# Altium schematic sheet 002_Buck_Converter.SchDoc: =title_line_1 + title_line_2
size 594 x 420 mm; SheetNumber: 2
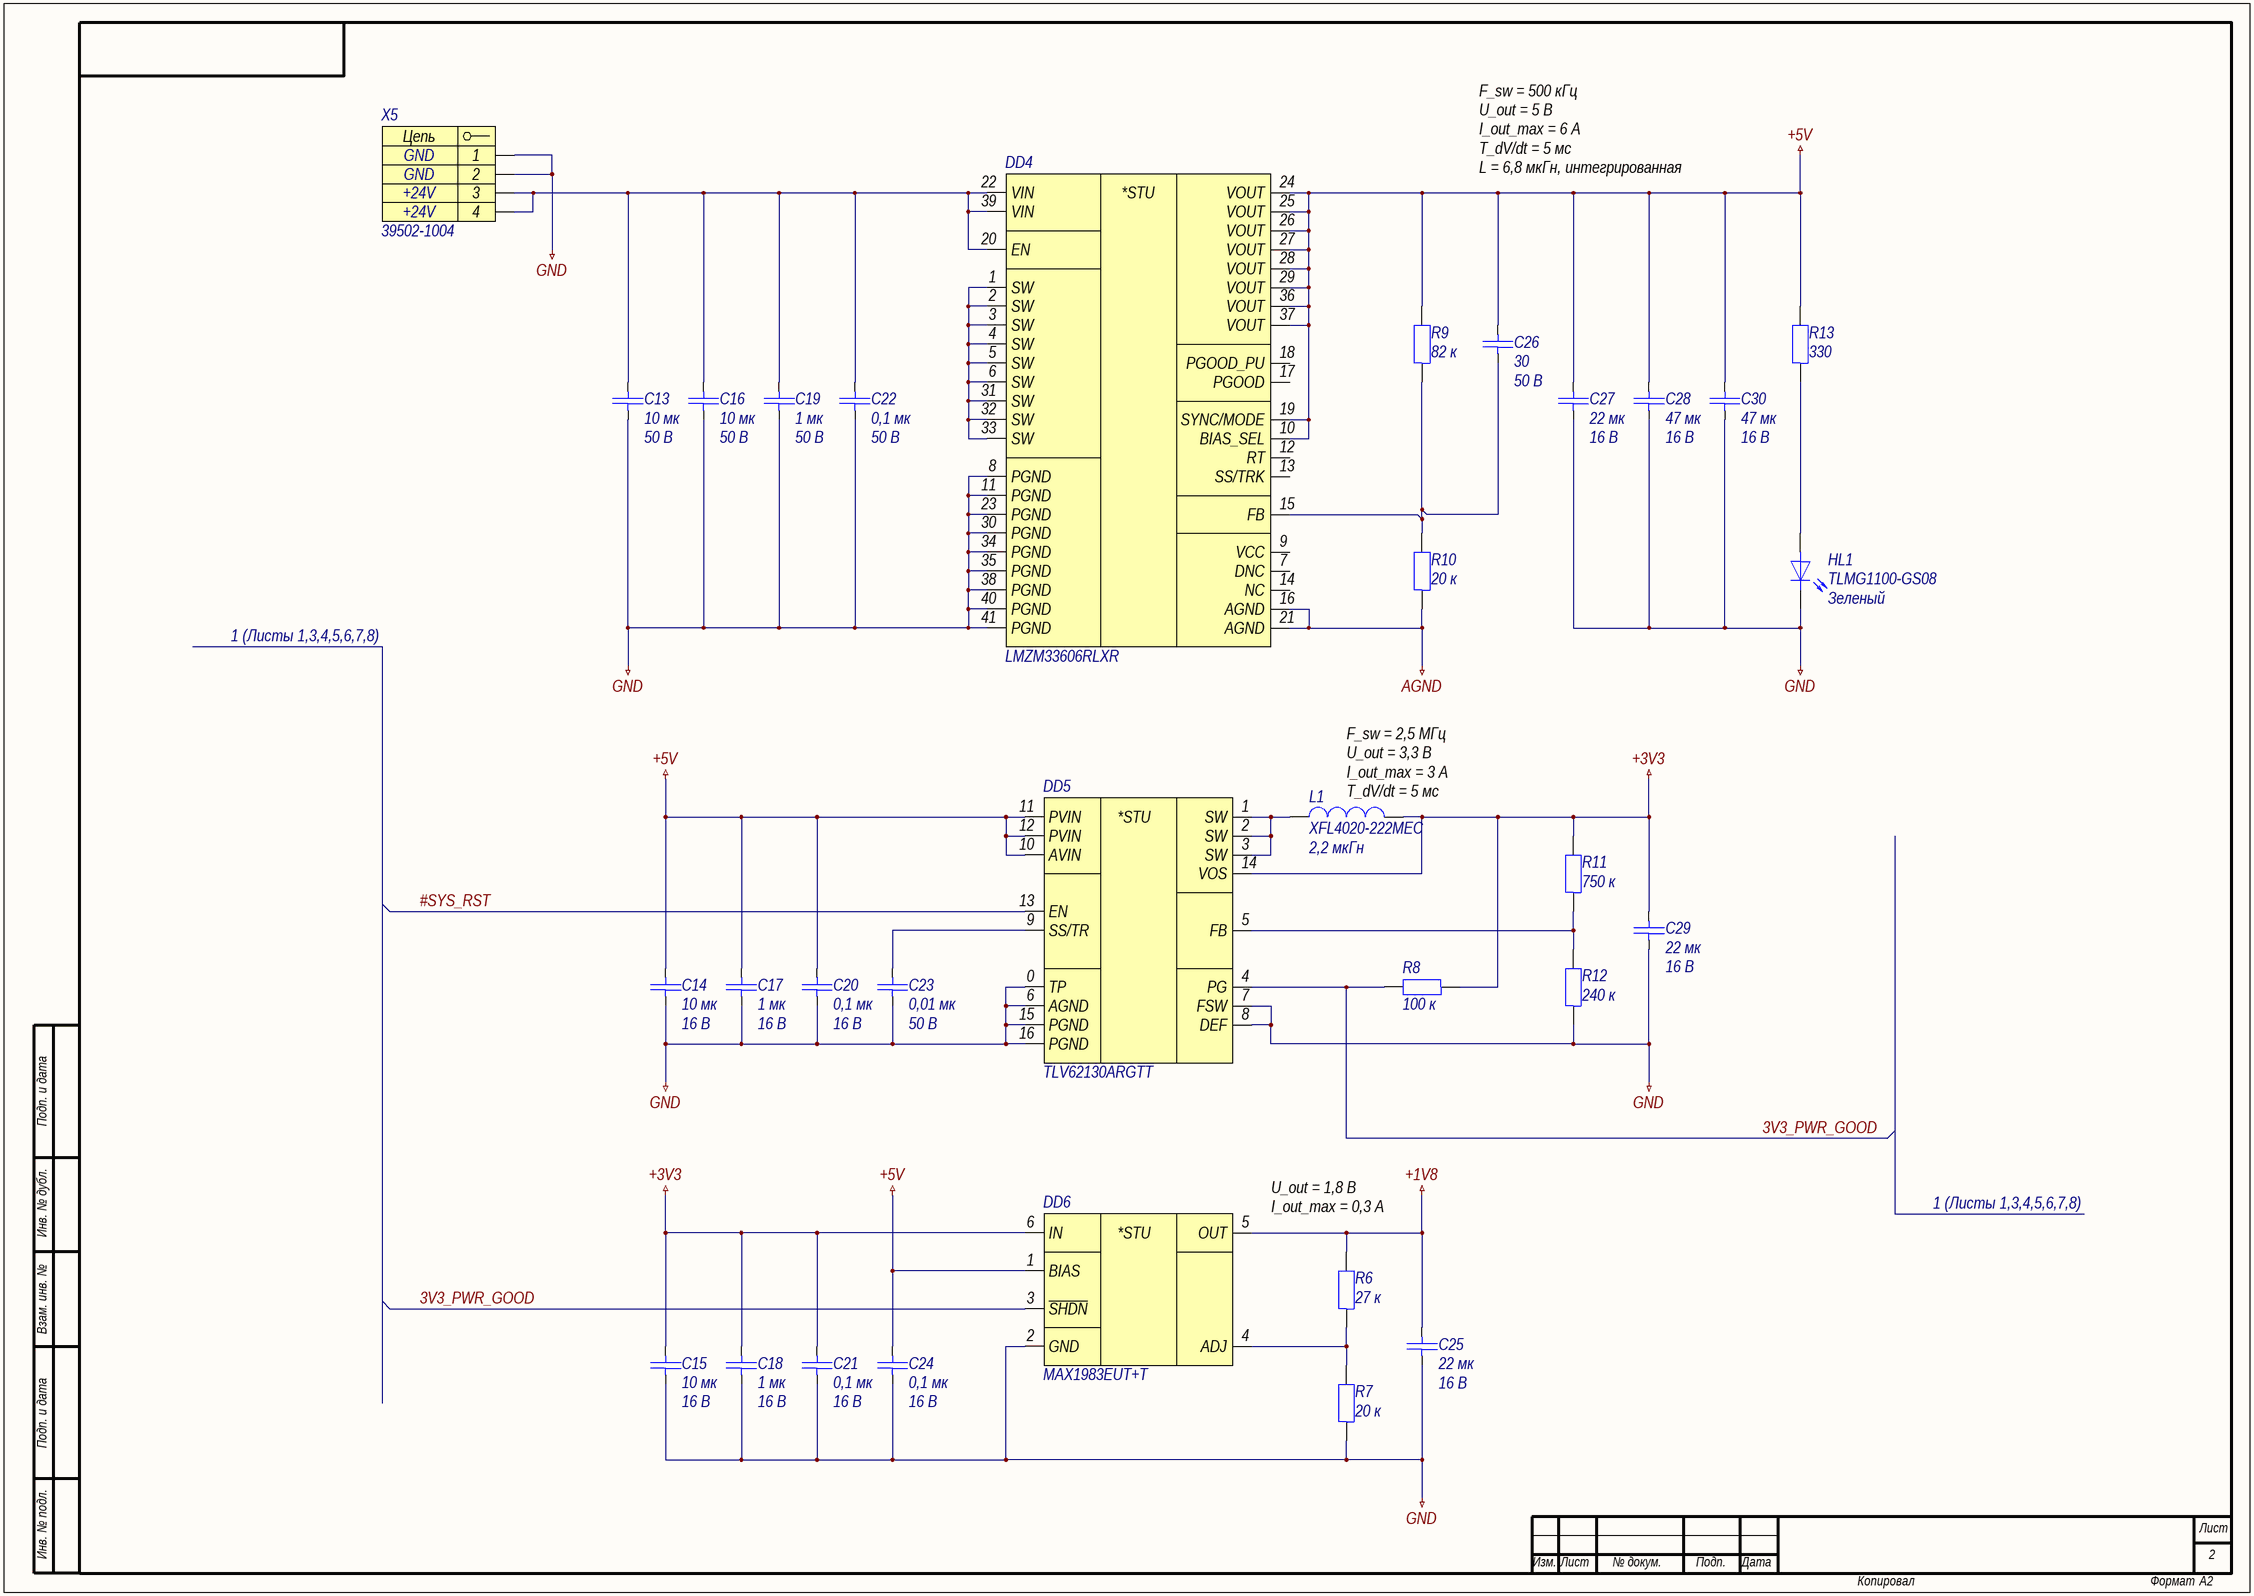
[diagram p0: 002_Buck_Converter.SchDoc]

## Parts
C13  10 мк  Напряжение: 50 В  [C0805]
C14  10 мк  Напряжение: 16 В  [C0603]
C15  10 мк  Напряжение: 16 В  [C0603]
C16  10 мк  Напряжение: 50 В  [C0805]
C17  1 мк  Напряжение: 16 В  [C0603]
C18  1 мк  Напряжение: 16 В  [C0603]
C19  1 мк  Напряжение: 50 В  [C0603]
C20  0,1 мк  Напряжение: 16 В  [C0603]
C21  0,1 мк  Напряжение: 16 В  [C0603]
C22  0,1 мк  Напряжение: 50 В  [C0603]
C23  0,01 мк  Напряжение: 50 В  [C0603]
C24  0,1 мк  Напряжение: 16 В  [C0603]
C25  22 мк  Напряжение: 16 В  [C0805]
C26  30  Напряжение: 50 В  [C0603]
C27  22 мк  Напряжение: 16 В  [C0805]
C28  47 мк  Напряжение: 16 В  [C1206]
C29  22 мк  Напряжение: 16 В  [C0805]
C30  47 мк  Напряжение: 16 В  [C1206]
DD4  LMZM33606RLXR  [B2QFN-41-1600X1000X410]
DD5  TLV62130ARGTT  [WQFN-16-P50-300X300X100-L40X24-T168X168]
DD6  MAX1983EUT+T  [SOT-23-6-P95-290X280X145]
HL1  TLMG1100-GS08  Цвет: Зеленый  [HL0603]
L1  XFL4020-222MEC  Индуктивность: 2,2 мкГн  [XFL-2-400X400X210]
R6  27 к  [R0603]
R7  20 к  [R0603]
R8  100 к  [R0603]
R9  82 к  [R0603]
R10  20 к  [R0603]
R11  750 к  [R0603]
R12  240 к  [R0603]
R13  330  [R0603]
X5  39502-1004  [39502-1004]

## Nets
+1V8: C25.1 DD6.5(OUT) R6.2
+3V3: C15.1 C18.1 C21.1 C29.1 DD5.14(VOS) DD6.6(IN) L1.2 R8.1 R11.2
+5V: C14.1 C17.1 C20.1 C24.1 C26.1 C27.1 C28.1 C30.1 DD4.10(BIAS_SEL) DD4.19(SYNC/MODE) DD4.24(VOUT) DD4.25(VOUT) DD4.26(VOUT) DD4.27(VOUT) DD4.28(VOUT) DD4.29(VOUT) DD4.36(VOUT) DD4.37(VOUT) DD5.10(AVIN) DD5.11(PVIN) DD5.12(PVIN) DD6.1(BIAS) R9.2 R13.2
AGND: DD4.16(AGND) DD4.21(AGND) R10.1
GND: C13.2 C14.2 C15.2 C16.2 C17.2 C18.2 C19.2 C20.2 C21.2 C22.2 C23.2 C24.2 C25.2 C27.2 C28.2 C29.2 C30.2 DD4.8(PGND) DD4.11(PGND) DD4.23(PGND) DD4.30(PGND) DD4.34(PGND) DD4.35(PGND) DD4.38(PGND) DD4.40(PGND) DD4.41(PGND) DD5.0(TP) DD5.6(AGND) DD5.7(FSW) DD5.8(DEF) DD5.15(PGND) DD5.16(PGND) DD6.2(GND) HL1.1 R7.1 R12.1 X5.1 X5.2
3V3_PWR_GOOD: DD5.4(PG) DD6.3(~{SHDN}) R8.2
#SYS_RST: DD5.13(EN)
NetC13_1: C13.1 C16.1 C19.1 C22.1 DD4.20(EN) DD4.22(VIN) DD4.39(VIN) X5.3 X5.4
NetC23_1: C23.1 DD5.9(SS/TR)
NetC26_2: C26.2 DD4.15(FB) R9.1 R10.2
NetDD4_1: DD4.1(SW) DD4.2(SW) DD4.3(SW) DD4.4(SW) DD4.5(SW) DD4.6(SW) DD4.31(SW) DD4.32(SW) DD4.33(SW)
NetDD5_1: DD5.1(SW) DD5.2(SW) DD5.3(SW) L1.1
NetDD5_5: DD5.5(FB) R11.1 R12.2
NetDD6_4: DD6.4(ADJ) R6.1 R7.2
NetHL1_2: HL1.2 R13.1

Not connected (* = marked no-connect by the designer): DD4 7(DNC) 9(VCC) 12(RT) 13(SS/TRK) 14(NC) 17(PGOOD) 18(PGOOD_PU)

## Notes on the sheet
- F_sw = 500 кГц
  U_out = 5 В
  I_out_max = 6 А
  T_dV/dt = 5 мс
  L = 6,8 мкГн, интегрированная
- 1 (Листы 1,3,4,5,6,7,8)
- (near L1) F_sw = 2,5 МГц
  U_out = 3,3 В
  I_out_max = 3 А
  T_dV/dt = 5 мс
- U_out = 1,8 В
  I_out_max = 0,3 А
- Подп. и дата
- Инв. № дубл.
- Взам. инв. №
- Инв. № подл.
- Лист
- Изм.
- № докум.
- Подп.
- Дата
- Копировал
- Формат
- А2
- (in symbol dd0001) *STU
- (in symbol dd0016) *STU
- (in symbol dd0017) *STU
- (in symbol x0051) Цепь

## Library data of the parts
C13 C16 = c0149: =Описание; ID: c0149; Фамилия: Паньков; Описание: Конденсатор керамический чип 0805 10 мкФ 50 В ±10 %; Наименование: CC0805KKX5R9BB106; Производитель: YAGEO Corp.; Отклонение: ±10 %; Рабочие температуры: от –55 °С до +85 °С; Температурный коэффициент емкости: X5R; Корпус: 0805; Номинал: 10 мк; Номинальное напряжение: 50 В; HelpURL: https://www.yageo.com/upload/media/product/productsearch/datasheet/mlcc/UPY-GPHC_X5R_4V-to-50V_26.pdf
C14 C15 = c0145: =Описание; ID: c0145; Фамилия: Паньков; Описание: Конденсатор керамический чип 0603 10 мкФ 16 В ±10 %; Наименование: CC0603KRX5R7BB106; Производитель: YAGEO Corp.; Отклонение: ±10 %; Рабочие температуры: от –55 °С до +85 °С; Температурный коэффициент емкости: X5R; Корпус: 0603; Номинал: 10 мк; Номинальное напряжение: 16 В; HelpURL: https://www.yageo.com/upload/media/product/productsearch/datasheet/mlcc/UPY-GPHC_X5R_4V-to-50V_26.pdf
C17 C18 = c0113: =Описание; ID: c0113; Фамилия: Паньков; Описание: Конденсатор керамический чип 0603 1 мкФ 16 В ±10 %; Наименование: CC0603KRX7R7BB105; Производитель: YAGEO Corp.; Отклонение: ±10 %; Рабочие температуры: от –55 °С до +125 °С; Температурный коэффициент емкости: X7R; Корпус: 0603; Номинал: 1 мк; Номинальное напряжение: 16 В; HelpURL: https://www.yageo.com/upload/media/product/productsearch/datasheet/mlcc/UPY-GPHC_X7R_6.3V-to-50V_20.pdf
C19 = c0117: =Описание; ID: c0117; Фамилия: Паньков; Описание: Конденсатор керамический чип 0603 1 мкФ 50 В ±10 %; Наименование: CC0603KRX7R9BB105; Производитель: YAGEO Corp.; Отклонение: ±10 %; Рабочие температуры: от –55 °С до +125 °С; Температурный коэффициент емкости: X7R; Корпус: 0603; Номинал: 1 мк; Номинальное напряжение: 50 В; HelpURL: https://www.yageo.com/upload/media/product/productsearch/datasheet/mlcc/UPY-GPHC_X7R_6.3V-to-50V_20.pdf
C20 C21 C24 = c0081: =Описание; ID: c0081; Фамилия: Паньков; Описание: Конденсатор керамический чип 0603 100 нФ 16 В ±10 %; Наименование: CC0603KRX7R7BB104; Производитель: YAGEO Corp.; Отклонение: ±10 %; Рабочие температуры: от –55 °С до +125 °С; Температурный коэффициент емкости: X7R; Корпус: 0603; Номинал: 0,1 мк; Номинальное напряжение: 16 В; HelpURL: https://www.yageo.com/upload/media/product/productsearch/datasheet/mlcc/UPY-GPHC_X7R_6.3V-to-50V_20.pdf
C22 = c0086: =Описание; ID: c0086; Фамилия: Паньков; Описание: Конденсатор керамический чип 0603 100 нФ 50 В ±10 %; Наименование: CC0603KRX7R9BB104; Производитель: YAGEO Corp.; Отклонение: ±10 %; Рабочие температуры: от –55 °С до +125 °С; Температурный коэффициент емкости: X7R; Корпус: 0603; Номинал: 0,1 мк; Номинальное напряжение: 50 В; HelpURL: https://www.yageo.com/upload/media/product/productsearch/datasheet/mlcc/UPY-GPHC_X7R_6.3V-to-50V_20.pdf
C23 = c0056: =Описание; ID: c0056; Фамилия: Паньков; Описание: Конденсатор керамический чип 0603 10 нФ 50 В ±10 %; Наименование: CC0603KRX7R9BB103; Производитель: YAGEO Corp.; Отклонение: ±10 %; Рабочие температуры: от –55 °С до +125 °С; Температурный коэффициент емкости: X7R; Корпус: 0603; Номинал: 0,01 мк; Номинальное напряжение: 50 В; HelpURL: https://www.yageo.com/upload/media/product/productsearch/datasheet/mlcc/UPY-GPHC_X7R_6.3V-to-50V_20.pdf
C25 C27 C29 = c0159: =Описание; ID: c0159; Фамилия: Паньков; Описание: Конденсатор керамический чип 0805 22 мкФ 16 В ±20 %; Наименование: CC0805MRX5R7BB226; Производитель: YAGEO Corp.; Отклонение: ±20 %; Рабочие температуры: от –55 °С до +85 °С; Температурный коэффициент емкости: X5R; Корпус: 0805; Номинал: 22 мк; Номинальное напряжение: 16 В; HelpURL: https://www.yageo.com/upload/media/product/productsearch/datasheet/mlcc/UPY-GPHC_X5R_4V-to-50V_26.pdf
C26 = c0022: =Описание; ID: c0022; Фамилия: Ларионов; Описание: Конденсатор керамический чип 0603 30 пФ 50 В ±5 %; Наименование: CC0603JRNPO9BN300; Производитель: YAGEO Corp.; Отклонение: ±5 %; Рабочие температуры: от –55 °С до +125 °С; Температурный коэффициент емкости: C0G; Корпус: 0603; Номинал: 30; Номинальное напряжение: 50 В; HelpURL: https://www.yageo.com/upload/media/product/productsearch/datasheet/mlcc/UPY-GP_NP0_16V-to-50V_18.pdf
C28 C30 = c0168: =Описание; ID: c0168; Фамилия: Паньков; Описание: Конденсатор керамический чип 1206 47 мкФ 16 В ±20 %; Наименование: CC1206MKX5R7BB476; Производитель: YAGEO Corp.; Отклонение: ±20 %; Рабочие температуры: от –55 °С до +85 °С; Температурный коэффициент емкости: X5R; Корпус: 1206; Номинал: 47 мк; Номинальное напряжение: 16 В; HelpURL: https://www.yageo.com/upload/media/product/productsearch/datasheet/mlcc/UPY-GPHC_X5R_4V-to-50V_26.pdf
DD4 = dd0016: =Описание; ID: dd0016; Фамилия: Ларионов; Описание: Понижающий преобразователь напряжения 3,5…36 В / 1,0…20 В и 6 А; Производитель: Texas Instruments Inc.; Входное напряжение: от 3,5 В до 36 В; Выходное напряжение: от 1,0 В до 20 В; Коммутируемый ток: до 6,0 А; Частота переключения: от 350 кГц до 2,2 МГц; Рабочие температуры: от –40 °С до +125 °С; Корпус: B2QFN-41; Наименование: LMZM33606RLXR; HelpURL: https://www.ti.com/product/LMZM33606
DD5 = dd0017: =Описание; ID: dd0017; Фамилия: Самарин; Описание: Понижающий преобразователь напряжения 3,0…17 В / 0,9…5,25 В и 3,0 А; Производитель: Texas Instruments Inc.; Входное напряжение: от 3,0 В до 17 В; Выходное напряжение: от 0,9 до 5,25 В; Коммутируемый ток: до 3,0 А; Частота переключения: от 1,25 МГц до 2,5 МГц; Рабочие температуры: от –40 °С до +85 °С; Корпус: WQFN-16; Наименование: TLV62130ARGTT; HelpURL: https://www.ti.com/product/TLV62130
DD6 = dd0001: =Описание; ID: dd0001; Фамилия: Ларионов; Описание: Линейный стабилизатор напряжения 1,25…5,5 В / 0,8…2,0 В и 0,3 А; Производитель: Maxim Integrated Products, Inc.; Входное напряжение: от 1,25 В до 5,5 В; Выходное напряжение: от 0,8 В до 2,0 В; Коммутируемый ток: до 0,3 А; Частота переключения: —; Рабочие температуры: от –40 °С до +85 °С; Корпус: SOT-23-6; Наименование: MAX1983EUT+T; HelpURL: https://www.maximintegrated.com/en/products/power/linear-regulators/MAX1983.html
HL1 = hl0005: =Описание; ID: hl0005; Фамилия: Ларионов; Описание: Светодиод чип 0603 зеленый; Производитель: Vishay Intertechnology, Inc.; Номинальная сила света: 35 мкд; Номинальная длина волны: 570 нм; Номинальный прямой ток: 30 мА; Номинальное падение напряжения: 2,1 В; Рассеиваемая мощность: 90 мВт; Рабочие температуры: от –40 °С до +100 °С; Корпус: 0603; Наименование: TLMG1100-GS08; HelpURL: https://www.vishay.com/leds/list/product-83173/
L1 = l0002: =Описание; ID: l0002; Фамилия: Ларионов; Описание: Катушка индуктивности 2,2 мкГн ±20 %; Производитель: Coilcraft, Inc.; Отклонение: ±20 %; Номинальное активное сопротивление: 21,35 мОм; Максимальное активное сопротивление: 23,5 мОм; Резонансная частота: 38 МГц; Номинальный ток (при нагреве на 20 °С/40 °С): 6 А; Ток насыщения: 3,5 А; Рабочее напряжение: от 0 В до 20 В; Рабочие температуры: от –40 °С до +125 °С; Корпус: 4,0 x 4,0 x 2,1; Наименование: XFL4020-222MEC; Номинал: 2,2 мкГн; HelpURL: https://www.coilcraft.com/en-us/products/power/shielded-inductors/molded-inductor/xfl/xfl4020/
R6 = r0120: =Описание; ID: r0120; Фамилия: Паньков; Описание: Резистор чип 0603 27 кОм ±1 % 0,1 Вт; Наименование: RC0603FR-0727KL; Производитель: YAGEO Corp.; Отклонение: ±1 %; Номинальное напряжение: 75 В; Номинальный ток: 1 А; Рабочие температуры: от –55 °С до +155 °С; Корпус: 0603; Примечание: Ряд E24; Номинал: 27 к; HelpURL: https://www.yageo.com/upload/media/product/productsearch/datasheet/rchip/PYu-RC_Group_51_RoHS_L_11.pdf
R7 R10 = r0115: =Описание; ID: r0115; Фамилия: Паньков; Описание: Резистор чип 0603 20 кОм ±1 % 0,1 Вт; Наименование: RC0603FR-0720KL; Производитель: YAGEO Corp.; Отклонение: ±1 %; Номинальное напряжение: 75 В; Номинальный ток: 1 А; Рабочие температуры: от –55 °С до +155 °С; Корпус: 0603; Примечание: Ряд E24; Номинал: 20 к; HelpURL: https://www.yageo.com/upload/media/product/productsearch/datasheet/rchip/PYu-RC_Group_51_RoHS_L_11.pdf
R8 = r0141: =Описание; ID: r0141; Фамилия: Водорезов; Описание: Резистор чип 0603 100 кОм ±1 % 0,1 Вт; Наименование: RC0603FR-07100KL; Производитель: YAGEO Corp.; Отклонение: ±1 %; Номинальное напряжение: 75 В; Номинальный ток: 1 А; Рабочие температуры: от –55 °С до +155 °С; Корпус: 0603; Примечание: Ряд E24; Номинал: 100 к; HelpURL: https://www.yageo.com/upload/media/product/productsearch/datasheet/rchip/PYu-RC_Group_51_RoHS_L_11.pdf
R9 = r0138: =Описание; ID: r0138; Фамилия: Паньков; Описание: Резистор чип 0603 82 кОм ±1 % 0,1 Вт; Наименование: RC0603FR-0782KL; Производитель: YAGEO Corp.; Отклонение: ±1 %; Номинальное напряжение: 75 В; Номинальный ток: 1 А; Рабочие температуры: от –55 °С до +155 °С; Корпус: 0603; Примечание: Ряд E24; Номинал: 82 к; HelpURL: https://www.yageo.com/upload/media/product/productsearch/datasheet/rchip/PYu-RC_Group_51_RoHS_L_11.pdf
R11 = r0170: =Описание; ID: r0170; Фамилия: Паньков; Описание: Резистор чип 0603 750 кОм ±1 % 0,1 Вт; Наименование: RC0603FR-07750KL; Производитель: YAGEO Corp.; Отклонение: ±1 %; Номинальное напряжение: 75 В; Номинальный ток: 1 А; Рабочие температуры: от –55 °С до +155 °С; Корпус: 0603; Примечание: Ряд E24; Номинал: 750 к; HelpURL: https://www.yageo.com/upload/media/product/productsearch/datasheet/rchip/PYu-RC_Group_51_RoHS_L_11.pdf
R12 = r0155: =Описание; ID: r0155; Фамилия: Паньков; Описание: Резистор чип 0603 240 кОм ±1 % 0,1 Вт; Наименование: RC0603FR-07240KL; Производитель: YAGEO Corp.; Отклонение: ±1 %; Номинальное напряжение: 75 В; Номинальный ток: 1 А; Рабочие температуры: от –55 °С до +155 °С; Корпус: 0603; Примечание: Ряд E24; Номинал: 240 к; HelpURL: https://www.yageo.com/upload/media/product/productsearch/datasheet/rchip/PYu-RC_Group_51_RoHS_L_11.pdf
R13 = r0064: =Описание; ID: r0064; Фамилия: Ларионов; Описание: Резистор чип 0603 330 Ом ±1 % 0,1 Вт; Наименование: RC0603FR-07330RL; Производитель: YAGEO Corp.; Отклонение: ±1 %; Номинальное напряжение: 75 В; Номинальный ток: 1 А; Рабочие температуры: от –55 °С до +155 °С; Корпус: 0603; Примечание: Ряд E24; Номинал: 330; HelpURL: https://www.yageo.com/upload/media/product/productsearch/datasheet/rchip/PYu-RC_Group_51_RoHS_L_11.pdf
X5 = x0051: =Описание; Contact_1: GND; Contact_3: +24V; ID: x0051; Фамилия: Шкабара; Описание: Terminal Block 4 pin 3,5 мм; Производитель: Molex; Contact_2: GND; Contact_4: +24V; Наименование: 39502-1004; HelpURL: https://www.molex.com/molex/products/part-detail/terminal_blocks/0395021004